# Altium schematic sheet HCMS-2975.SchDoc
size A4
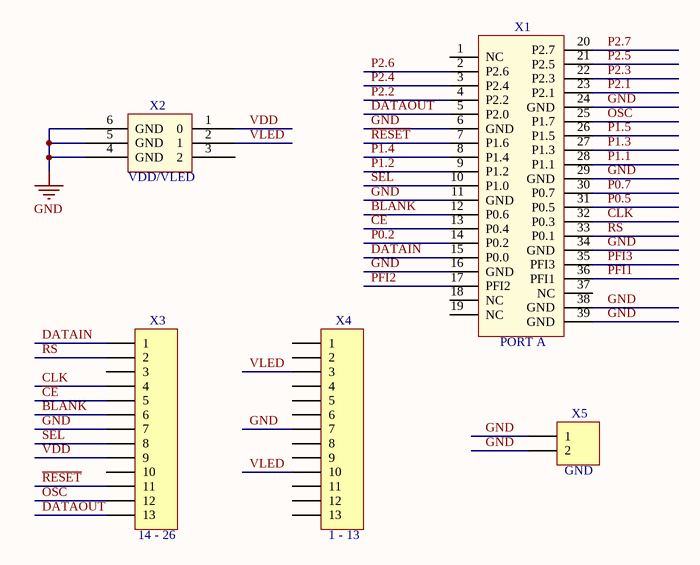
[diagram p0: HCMS-2975.SchDoc]

## Parts
X1  PORT A  [CHEAP_CONN_FEMALE]
X2  VDD/VLED  [POWER]
X3  14 - 26  [HDR1X13]
X4  1 - 13  [HDR1X13]
X5  GND  [HDR1X2]

## Nets
GND: X1.6(GND) X1.11(GND) X1.16(GND) X1.24(GND) X1.29(GND) X1.34(GND) X1.38(GND) X1.39(GND) X2.4(GND) X2.5(GND) X2.6(GND) X3.7 X4.7 X5.1 X5.2
BLANK: X1.12(P0.6) X3.6
~{CE}: X1.13(P0.4) X3.5
CLK: X1.32(P0.3) X3.4
DATAIN: X1.15(P0.0) X3.1
DATAOUT: X1.5(P2.0) X3.13
OSC: X1.25(P1.7) X3.12
P0.2: X1.14(P0.2)
P0.5: X1.31(P0.5)
P0.7: X1.30(P0.7)
P1.1: X1.28(P1.1)
P1.2: X1.9(P1.2)
P1.3: X1.27(P1.3)
P1.4: X1.8(P1.4)
P1.5: X1.26(P1.5)
P2.1: X1.23(P2.1)
P2.2: X1.4(P2.2)
P2.3: X1.22(P2.3)
P2.4: X1.3(P2.4)
P2.5: X1.21(P2.5)
P2.6: X1.2(P2.6)
P2.7: X1.20(P2.7)
PFI1: X1.36(PFI1)
PFI2: X1.17(PFI2)
PFI3: X1.35(PFI3)
~{RESET}: X1.7(P1.6) X3.11
RS: X1.33(P0.1) X3.2
SEL: X1.10(P1.0) X3.8
VDD: X2.1(0) X3.9
VLED: X2.2(1) X4.3 X4.10

Not connected (* = marked no-connect by the designer): X1 1(NC) 18(NC) 19(NC) 37(NC); X2 3(2); X3 3 10; X4 1 2 4 5 6 8 9 11 12 13

## Library data of the parts
X1 = CHEAP_CON_37_FEMALE
X2 = POWER
X3 X4 = Header 13: Header, 13-Pin; LatestRevisionDate: 17-Jul-2002; LatestRevisionNote: Re-released for DXP Platform.; Publisher: Altium Limited
X5 = Header 2: Header, 2-Pin; LatestRevisionDate: 17-Jul-2002; LatestRevisionNote: Re-released for DXP Platform.; Publisher: Altium Limited